# EAGLE design juan_foot (EAGLE 8.0.1)
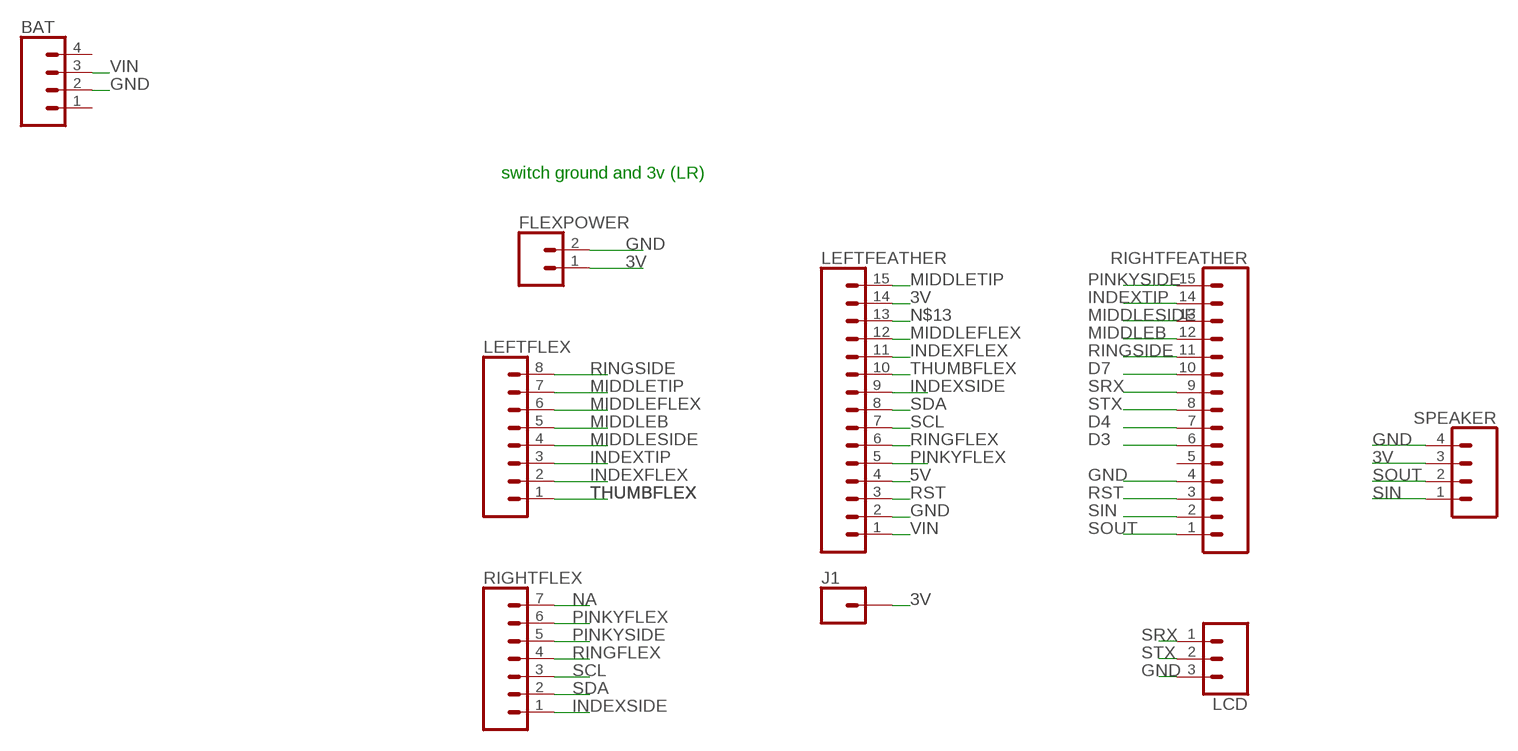
[diagram p0: schematic, sheet 1]

## Parts
BAT  CONN_04  [1X04]
FLEXPOWER  CONN_02  [1X02]
J1  CONN_01  [1X01]
LCD  CONN_03  [1X03]
LEFTFEATHER  CONN_15  [1X15]
LEFTFLEX  CONN_08"  [1X08]
RIGHTFEATHER  CONN_15  [1X15]
RIGHTFLEX  CONN_07  [1X07]
SPEAKER  CONN_04  [1X04]

## Nets
3V: FLEXPOWER.1 J1.1 LEFTFEATHER.14 SPEAKER.3
5V: LEFTFEATHER.4
D3: RIGHTFEATHER.6
D4: RIGHTFEATHER.7
D7: RIGHTFEATHER.10
GND: BAT.2 FLEXPOWER.2 LCD.3 LEFTFEATHER.2 RIGHTFEATHER.4 SPEAKER.4
INDEXFLEX: LEFTFEATHER.11 LEFTFLEX.2
INDEXSIDE: LEFTFEATHER.9 RIGHTFLEX.1
INDEXTIP: LEFTFLEX.3 RIGHTFEATHER.14
MIDDLEB: LEFTFLEX.5 RIGHTFEATHER.12
MIDDLEFLEX: LEFTFEATHER.12 LEFTFLEX.6
MIDDLESIDE: LEFTFLEX.4 RIGHTFEATHER.13
MIDDLETIP: LEFTFEATHER.15 LEFTFLEX.7
N$13: LEFTFEATHER.13
NA: RIGHTFLEX.7
PINKYFLEX: LEFTFEATHER.5 RIGHTFLEX.6
PINKYSIDE: RIGHTFEATHER.15 RIGHTFLEX.5
RINGFLEX: LEFTFEATHER.6 RIGHTFLEX.4
RINGSIDE: LEFTFLEX.8 RIGHTFEATHER.11
RST: LEFTFEATHER.3 RIGHTFEATHER.3
SCL: LEFTFEATHER.7 RIGHTFLEX.3
SDA: LEFTFEATHER.8 RIGHTFLEX.2
SIN: RIGHTFEATHER.2 SPEAKER.1
SOUT: RIGHTFEATHER.1 SPEAKER.2
SRX: LCD.1 RIGHTFEATHER.9
STX: LCD.2 RIGHTFEATHER.8
THUMBFLEX: LEFTFEATHER.10 LEFTFLEX.1
VIN: BAT.3 LEFTFEATHER.1
Unconnected: BAT.1 BAT.4 RIGHTFEATHER.5

## Notes on the sheet
- switch ground and 3v (LR)

## Library data of the parts
BAT SPEAKER = SparkFun-Connectors:CONN_04: Multi connection point. Often used as Generic Header-pin footprint for 0.1 inch spaced/style header connections On any of the 0.1 inch spaced packages, you can populate with these: Break Away Headers - Straight <https://www.sparkfun.com/products/116> (PRT-00116) Break Away Male Headers - Right Angle <https://www.sparkfun.com/products/553> (PRT-00553) Female Headers <https://www.sparkfun.com/products/115> (PRT-00115) Break Away Headers - Machine Pin <https://www.sparkfun.com/products/117> (PRT-00117) Break Away Female Headers - Swiss Machine Pin <https://www.sparkfun.com/products/743> (PRT-00743) For SCREWTERMINALS and SPRING TERMINALS visit here: Screw Terimnals on SparkFun.com <https://www.sparkfun.com/search/results?term=Screw+Terminals> (5mm/3.5mm/2.54mm spacing) This device is also useful as a general connection point to wire up your design to another part of your project. Our various solder wires solder well into these plated through hole pads. Hook-Up Wire - Assortment (Stranded, 22 AWG) <https://www.sparkfun.com/products/11375> (PRT-11375) Hook-Up Wire - Assortment (Solid Core, 22 AWG) <https://www.sparkfun.com/products/11367> (PRT-11367) View the entire wire category on our website here <https://www.sparkfun.com/categories/141> Special notes: Molex polarized connector foot print use with SKU : PRT-08231 with associated crimp pins and housings. 1MM SMD Version SKU: PRT-10208; PROD_ID: CONN-09696
FLEXPOWER = SparkFun-Connectors:CONN_02: Multi connection point. Often used as Generic Header-pin footprint for 0.1 inch spaced/style header connections On any of the 0.1 inch spaced packages, you can populate with these: Break Away Headers - Straight <https://www.sparkfun.com/products/116> (PRT-00116) Break Away Male Headers - Right Angle <https://www.sparkfun.com/products/553> (PRT-00553) Female Headers <https://www.sparkfun.com/products/115> (PRT-00115) Break Away Headers - Machine Pin <https://www.sparkfun.com/products/117> (PRT-00117) Break Away Female Headers - Swiss Machine Pin <https://www.sparkfun.com/products/743> (PRT-00743) For SCREWTERMINALS and SPRING TERMINALS visit here: Screw Terimnals on SparkFun.com <https://www.sparkfun.com/search/results?term=Screw+Terminals> (5mm/3.5mm/2.54mm spacing) This device is also useful as a general connection point to wire up your design to another part of your project. Our various solder wires solder well into these plated through hole pads. Hook-Up Wire - Assortment (Stranded, 22 AWG) <https://www.sparkfun.com/products/11375> (PRT-11375) Hook-Up Wire - Assortment (Solid Core, 22 AWG) <https://www.sparkfun.com/products/11367> (PRT-11367) View the entire wire category on our website here <https://www.sparkfun.com/categories/141> Special notes: Molex polarized connector foot print use with: PRT-08233 with associated crimp pins and housings. 2.54_SCREWTERM for use with PRT-10571. 3.5mm Screw Terminal footprints for PRT-08084 5mm Screw Terminal footprints for use with PRT-08432
J1 = SparkFun-Connectors:CONN_01: Single connection point. Often used as Generic Header-pin footprint for 0.1 inch spaced/style header connections On any of the 0.1 inch spaced packages, you can populate with these: Break Away Headers - Straight <https://www.sparkfun.com/products/116> (PRT-00116) Break Away Male Headers - Right Angle <https://www.sparkfun.com/products/553> (PRT-00553) Female Headers <https://www.sparkfun.com/products/115> (PRT-00115) Break Away Headers - Machine Pin <https://www.sparkfun.com/products/117> (PRT-00117) Break Away Female Headers - Swiss Machine Pin <https://www.sparkfun.com/products/743> (PRT-00743) This device is also useful as a general connection point to wire up your design to another part of your project. Our various solder wires solder well into these plated through hole pads. Hook-Up Wire - Assortment (Stranded, 22 AWG) <https://www.sparkfun.com/products/11375> (PRT-11375) Hook-Up Wire - Assortment (Solid Core, 22 AWG) <https://www.sparkfun.com/products/11367> (PRT-11367) View the entire wire category on our website here <https://www.sparkfun.com/categories/141> Special notes: SMTSO-256-ET is a "flush mount" nut for a 4-40 screw. We mostly use this on specialty testbeds; it is a nice way to connect hardware to your PCB at an adjustable hieght. Also note, the SNAP packages are for using a snappable style connector. We sell a baggie of snaps and they are also used on two LilyPad designs: Snap Assortment - 30 pack (male and female) <https://www.sparkfun.com/products/11347> (DEV-11347) LilyPad Arduino SimpleSnap <https://www.sparkfun.com/products/10941> (DEV-10941) LilyPad SimpleSnap Protoboard <https://www.sparkfun.com/products/10940> (DEV-10940)
LCD = SparkFun-Connectors:CONN_03: Multi connection point. Often used as Generic Header-pin footprint for 0.1 inch spaced/style header connections On any of the 0.1 inch spaced packages, you can populate with these: Break Away Headers - Straight <https://www.sparkfun.com/products/116> (PRT-00116) Break Away Male Headers - Right Angle <https://www.sparkfun.com/products/553> (PRT-00553) Female Headers <https://www.sparkfun.com/products/115> (PRT-00115) Break Away Headers - Machine Pin <https://www.sparkfun.com/products/117> (PRT-00117) Break Away Female Headers - Swiss Machine Pin <https://www.sparkfun.com/products/743> (PRT-00743) Stackable Header - 3 Pin (Female, 0.1") <https://www.sparkfun.com/products/13875> (PRT-13875) For SCREWTERMINALS and SPRING TERMINALS visit here: Screw Terimnals on SparkFun.com <https://www.sparkfun.com/search/results?term=Screw+Terminals> (5mm/3.5mm/2.54mm spacing) This device is also useful as a general connection point to wire up your design to another part of your project. Our various solder wires solder well into these plated through hole pads. Hook-Up Wire - Assortment (Stranded, 22 AWG) <https://www.sparkfun.com/products/11375> (PRT-11375) Hook-Up Wire - Assortment (Solid Core, 22 AWG) <https://www.sparkfun.com/products/11367> (PRT-11367) View the entire wire category on our website here <https://www.sparkfun.com/categories/141> Special notes: Molex polarized connector foot print use with SKU : PRT-08232 with associated crimp pins and housings.
LEFTFEATHER RIGHTFEATHER = SparkFun-Connectors:CONN_15: Multi connection point. Often used as Generic Header-pin footprint for 0.1 inch spaced/style header connections On any of the 0.1 inch spaced packages, you can populate with these: Break Away Headers - Straight <https://www.sparkfun.com/products/116> (PRT-00116) Break Away Male Headers - Right Angle <https://www.sparkfun.com/products/553> (PRT-00553) Female Headers <https://www.sparkfun.com/products/115> (PRT-00115) Break Away Headers - Machine Pin <https://www.sparkfun.com/products/117> (PRT-00117) Break Away Female Headers - Swiss Machine Pin <https://www.sparkfun.com/products/743> (PRT-00743) For SCREWTERMINALS and SPRING TERMINALS visit here: Screw Terimnals on SparkFun.com <https://www.sparkfun.com/search/results?term=Screw+Terminals> (5mm/3.5mm/2.54mm spacing) This device is also useful as a general connection point to wire up your design to another part of your project. Our various solder wires solder well into these plated through hole pads. Hook-Up Wire - Assortment (Stranded, 22 AWG) <https://www.sparkfun.com/products/11375> (PRT-11375) Hook-Up Wire - Assortment (Solid Core, 22 AWG) <https://www.sparkfun.com/products/11367> (PRT-11367) View the entire wire category on our website here <https://www.sparkfun.com/categories/141> Special notes: Molex polarized connector foot print use with SKU : PRT-08231 with associated crimp pins and housings. 1MM SMD Version SKU: PRT-10208 NOTES ON THE VARIANTS LOCK and LOCK_LONGPADS... This footprint was designed to help hold the alignment of a through-hole component (i.e. 6-pin header) while soldering it into place. You may notice that each hole has been shifted either up or down by 0.005 of an inch from it's more standard position (which is a perfectly straight line). This slight alteration caused the pins (the squares in the middle) to touch the edges of the holes. Because they are alternating, it causes a "brace" to hold the component in place. 0.005 has proven to be the perfect amount of "off-center" position when using our standard breakaway headers. Although looks a little odd when you look at the bare footprint, once you have a header in there, the alteration is very hard to notice. Also,if you push a header all the way into place, it is covered up entirely on the bottom side.
LEFTFLEX = SparkFun-Connectors:CONN_08: Multi connection point. Often used as Generic Header-pin footprint for 0.1 inch spaced/style header connections On any of the 0.1 inch spaced packages, you can populate with these: Break Away Headers - Straight <https://www.sparkfun.com/products/116> (PRT-00116) Break Away Male Headers - Right Angle <https://www.sparkfun.com/products/553> (PRT-00553) Female Headers <https://www.sparkfun.com/products/115> (PRT-00115) Break Away Headers - Machine Pin <https://www.sparkfun.com/products/117> (PRT-00117) Break Away Female Headers - Swiss Machine Pin <https://www.sparkfun.com/products/743> (PRT-00743) Arduino Stackable Header - 8 Pin <https://www.sparkfun.com/products/9279> (PRT-09279) For SCREWTERMINALS and SPRING TERMINALS visit here: Screw Terimnals on SparkFun.com <https://www.sparkfun.com/search/results?term=Screw+Terminals> (5mm/3.5mm/2.54mm spacing) This device is also useful as a general connection point to wire up your design to another part of your project. Our various solder wires solder well into these plated through hole pads. Hook-Up Wire - Assortment (Stranded, 22 AWG) <https://www.sparkfun.com/products/11375> (PRT-11375) Hook-Up Wire - Assortment (Solid Core, 22 AWG) <https://www.sparkfun.com/products/11367> (PRT-11367) View the entire wire category on our website here <https://www.sparkfun.com/categories/141> Special notes: Molex polarized connector foot print use with SKU : PRT-08231 with associated crimp pins and housings. 1MM SMD Version SKU: PRT-10208 NOTES ON THE VARIANTS LOCK and LOCK_LONGPADS... This footprint was designed to help hold the alignment of a through-hole component (i.e. 6-pin header) while soldering it into place. You may notice that each hole has been shifted either up or down by 0.005 of an inch from it's more standard position (which is a perfectly straight line). This slight alteration caused the pins (the squares in the middle) to touch the edges of the holes. Because they are alternating, it causes a "brace" to hold the component in place. 0.005 has proven to be the perfect amount of "off-center" position when using our standard breakaway headers. Although looks a little odd when you look at the bare footprint, once you have a header in there, the alteration is very hard to notice. Also,if you push a header all the way into place, it is covered up entirely on the bottom side.; PROD_ID: CONN-08438
RIGHTFLEX = SparkFun-Connectors:CONN_07: Multi connection point. Often used as Generic Header-pin footprint for 0.1 inch spaced/style header connections On any of the 0.1 inch spaced packages, you can populate with these: Break Away Headers - Straight <https://www.sparkfun.com/products/116> (PRT-00116) Break Away Male Headers - Right Angle <https://www.sparkfun.com/products/553> (PRT-00553) Female Headers <https://www.sparkfun.com/products/115> (PRT-00115) Break Away Headers - Machine Pin <https://www.sparkfun.com/products/117> (PRT-00117) Break Away Female Headers - Swiss Machine Pin <https://www.sparkfun.com/products/743> (PRT-00743) For SCREWTERMINALS and SPRING TERMINALS visit here: Screw Terimnals on SparkFun.com <https://www.sparkfun.com/search/results?term=Screw+Terminals> (5mm/3.5mm/2.54mm spacing) This device is also useful as a general connection point to wire up your design to another part of your project. Our various solder wires solder well into these plated through hole pads. Hook-Up Wire - Assortment (Stranded, 22 AWG) <https://www.sparkfun.com/products/11375> (PRT-11375) Hook-Up Wire - Assortment (Solid Core, 22 AWG) <https://www.sparkfun.com/products/11367> (PRT-11367) View the entire wire category on our website here <https://www.sparkfun.com/categories/141> Special notes: Molex polarized connector foot print use with SKU : PRT-08231 with associated crimp pins and housings. 1MM SMD Version SKU: PRT-10208 NOTES ON THE VARIANTS LOCK and LOCK_LONGPADS... This footprint was designed to help hold the alignment of a through-hole component (i.e. 6-pin header) while soldering it into place. You may notice that each hole has been shifted either up or down by 0.005 of an inch from it's more standard position (which is a perfectly straight line). This slight alteration caused the pins (the squares in the middle) to touch the edges of the holes. Because they are alternating, it causes a "brace" to hold the component in place. 0.005 has proven to be the perfect amount of "off-center" position when using our standard breakaway headers. Although looks a little odd when you look at the bare footprint, once you have a header in there, the alteration is very hard to notice. Also,if you push a header all the way into place, it is covered up entirely on the bottom side.

## Board
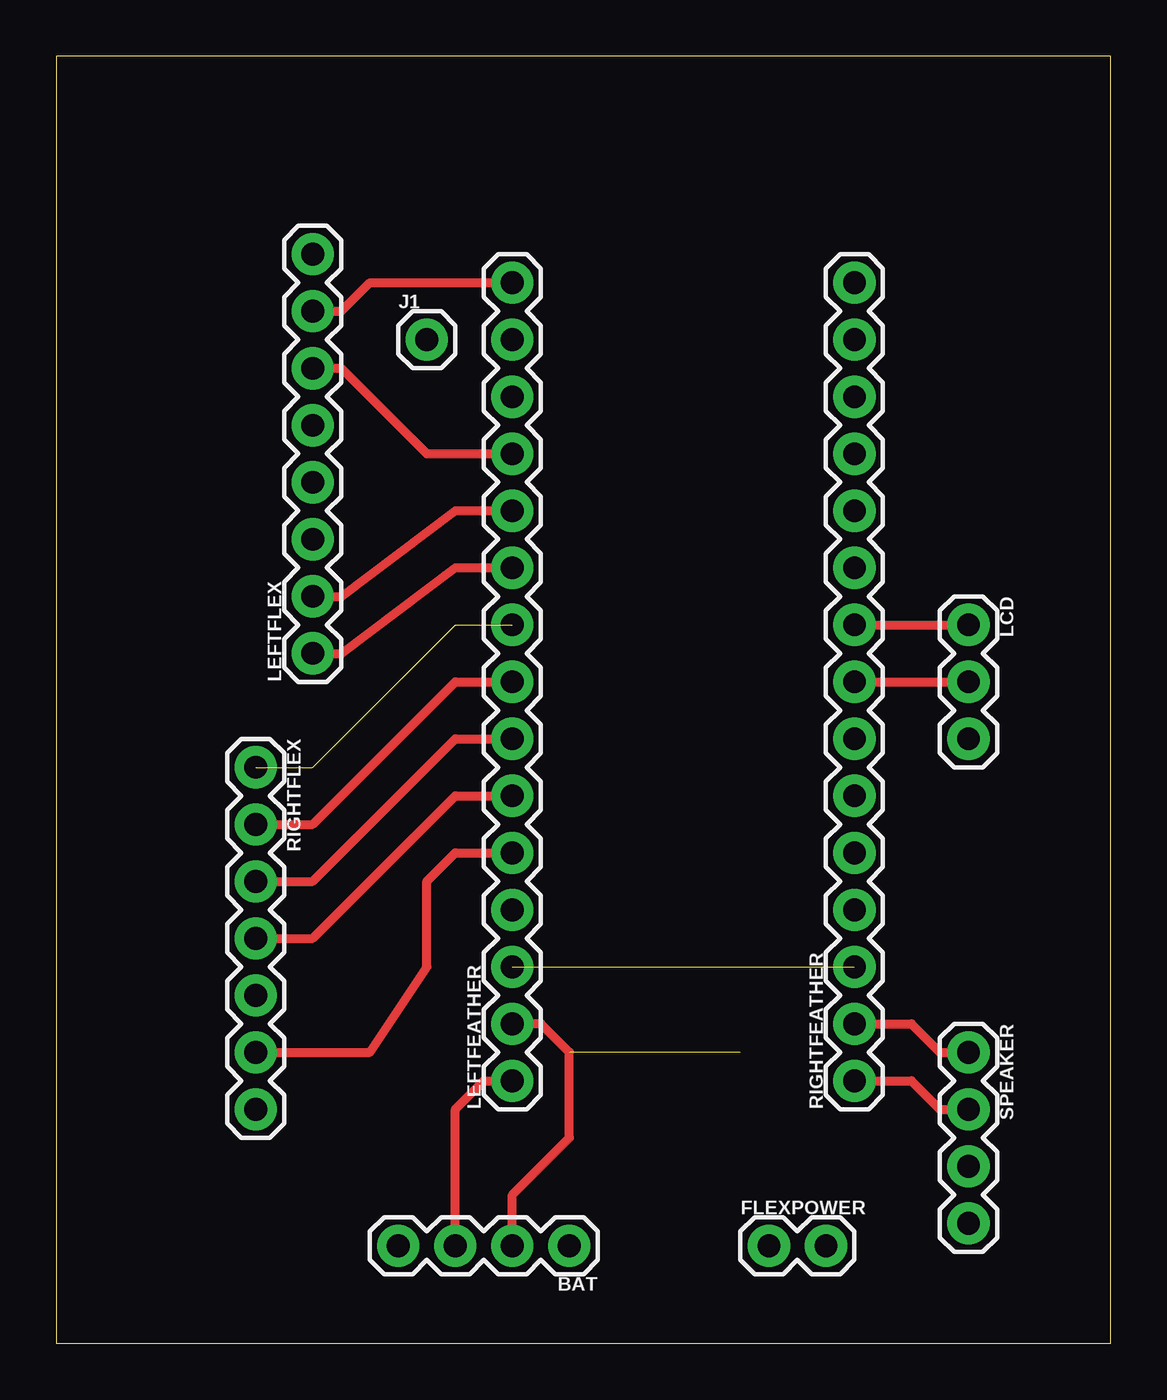
[diagram p1: board, top side]
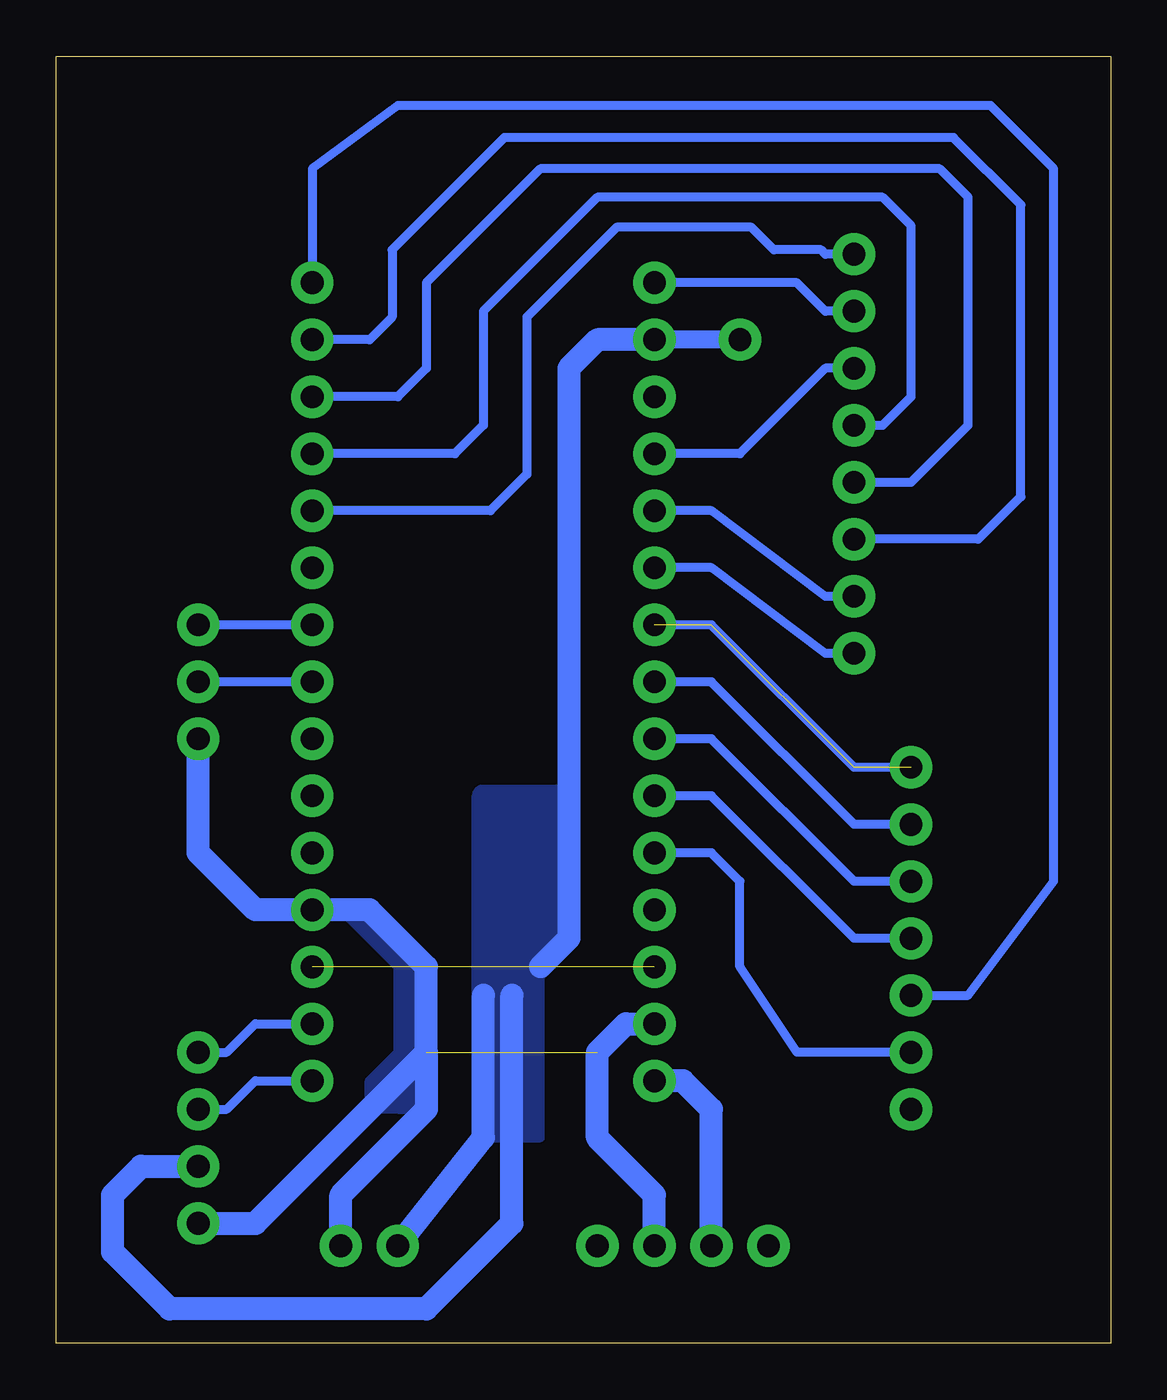
[diagram p2: board, bottom side, seen from below]

Size 46.97 x 57.36 mm. Coordinates in mm from the lower left corner, seen from the top.
Outline: 0,0 46.97,0 46.97,57.36 0,57.36 0,0
Copper layers (1*16): Top 0.035mm / dielectric 1.5mm / Bottom 0.035mm
Design rules "default": minimum track width 10mil, minimum drill 24mil, track to track 8mil, track to pad 8mil, pad to pad 8mil, via to via 8mil, smd to smd 8mil, copper to edge 40mil, drill to drill 8mil, minimum pad ring 10mil, minimum via ring 8mil, stop-mask expansion 4mil, vias tented up to drill 0mil, thermal gap 10mil

### Footprints (pad centres in the part's own frame; a part is rotated, then mirrored left to right if it is on the bottom)
1X04 = drill 1.016 pad 1.88: 1 0,0; 2 2.54,0; 3 5.08,0; 4 7.62,0
1X02 = drill 1.016 pad 1.88: 1 0,0; 2 2.54,0
1X01 = drill 1.016 pad 1.88: 1 0,0
1X03 = drill 1.016 pad 1.88: 1 0,0; 2 2.54,0; 3 5.08,0
1X15 = drill 1.016 pad 1.88: 1 0,0; 2 2.54,0; 3 5.08,0; 4 7.62,0; 5 10.16,0; 6 12.7,0; 7 15.24,0; 8 17.78,0; 9 20.32,0; 10 22.86,0; 11 25.4,0; 12 27.94,0; 13 30.48,0; 14 33.02,0; 15 35.56,0
1X08 = drill 1.016 pad 1.88: 1 0,0; 2 2.54,0; 3 5.08,0; 4 7.62,0; 5 10.16,0; 6 12.7,0; 7 15.24,0; 8 17.78,0
1X07 = drill 1.016 pad 1.88: 1 0,0; 2 2.54,0; 3 5.08,0; 4 7.62,0; 5 10.16,0; 6 12.7,0; 7 15.24,0

### Placement (x,y rotation side)
BAT  22.86,4.35 180 top
FLEXPOWER  31.75,4.35 0 top
J1  16.51,44.72 0 top
LCD  40.64,32.02 270 top
LEFTFEATHER  20.32,11.7 90 top
LEFTFLEX  11.43,30.75 90 top
RIGHTFEATHER  35.56,11.7 90 top
RIGHTFLEX  8.89,25.67 270 top
SPEAKER  40.64,12.97 270 top

### Tracks (layer width: path | path; a pad name or v marks a point on that pad's centre or on a via)
3V
  Bottom 0.813: J1.1 LEFTFEATHER.14
  Bottom 1.016: LEFTFEATHER.14 22.86,44.72 24.13,43.45 24.13,18.05 25.4,16.78 | SPEAKER.3 43.18,7.89 44.45,6.62 44.45,4.08 41.91,1.54 30.48,1.54 26.67,5.35 26.67,15.51 | FLEXPOWER.1 27.94,9.16 27.94,15.51
  pour Bottom: 25.4,9.16 25.4,16.78 27.94,16.78 27.94,9.16
  pour Bottom: 27.94,15.51 27.94,24.4 24.13,24.4 24.13,18.05 26.67,15.51
GND  (1 unrouted)
  Top 0.406: BAT.2 20.32,6.62 22.86,9.16 22.86,12.97 21.59,14.24 LEFTFEATHER.2
  Bottom 1.016: LEFTFEATHER.2 21.59,14.24 22.86,12.97 22.86,9.16 20.32,6.62 BAT.2 | FLEXPOWER.2 34.29,6.62 30.48,10.43 30.48,12.97 | 30.48,12.97 30.48,16.78 33.02,19.32 RIGHTFEATHER.4 38.1,19.32 40.64,21.86 LCD.3 | SPEAKER.4 38.1,5.35 30.48,12.97
  pour Bottom: 30.48,16.78 31.75,16.78 31.75,10.43 30.48,10.43
  pour Bottom: 30.48,10.43 33.02,10.43 33.02,11.7 31.75,12.97 30.48,12.97
  pour Bottom: 31.75,16.78 34.29,19.32 33.02,19.32 30.48,16.78
INDEXFLEX
  Top 0.406: LEFTFLEX.2 12.7,33.29 17.78,37.1 LEFTFEATHER.11
  Bottom 0.406: LEFTFLEX.2 12.7,33.29 17.78,37.1 LEFTFEATHER.11
INDEXSIDE  (3 unrouted)
  Bottom 0.406: RIGHTFLEX.1 11.43,25.67 17.78,32.02 LEFTFEATHER.9
INDEXTIP
  Bottom 0.406: RIGHTFEATHER.14 33.01,44.72 32,45.73 32,48.73 27,53.73 7,53.73 4,50.73 4,37.73 5.9,35.83 LEFTFLEX.3
MIDDLEB
  Bottom 0.406: RIGHTFEATHER.12 29.21,39.64 27.94,40.91 27.94,45.99 22.86,51.07 10.16,51.07 8.89,49.8 8.89,42.18 10.16,40.91 LEFTFLEX.5
MIDDLEFLEX
  Top 0.406: LEFTFLEX.6 12.7,43.45 16.51,39.64 LEFTFEATHER.12
  Bottom 0.406: LEFTFLEX.6 12.7,43.45 16.51,39.64 LEFTFEATHER.12
MIDDLESIDE
  Bottom 0.406: LEFTFLEX.4 8.89,38.37 6.35,40.91 6.35,51.07 7.62,52.34 25.4,52.34 30.48,47.26 30.48,43.45 31.75,42.18 RIGHTFEATHER.13
MIDDLETIP
  Top 0.406: LEFTFLEX.7 12.7,45.99 13.97,47.26 LEFTFEATHER.15
  Bottom 0.406: LEFTFLEX.7 12.7,45.99 13.97,47.26 LEFTFEATHER.15
PINKYFLEX
  Top 0.406: RIGHTFLEX.6 13.97,12.97 16.51,16.78 16.51,20.59 17.78,21.86 LEFTFEATHER.5
  Bottom 0.406: RIGHTFLEX.6 13.97,12.97 16.51,16.78 16.51,20.59 17.78,21.86 LEFTFEATHER.5
PINKYSIDE
  Bottom 0.406: RIGHTFLEX.5 6.35,15.51 2.54,20.59 2.54,52.34 5.35,55.15 31.75,55.15 35.56,52.34 RIGHTFEATHER.15
RINGFLEX
  Top 0.406: RIGHTFLEX.4 11.43,18.05 17.78,24.4 LEFTFEATHER.6
  Bottom 0.406: RIGHTFLEX.4 11.43,18.05 17.78,24.4 LEFTFEATHER.6
RINGSIDE
  Bottom 0.406: LEFTFLEX.8 12.7,48.53 12.9,48.73 15,48.73 16,49.73 22,49.73 26,45.73 26,38.73 27.63,37.1 RIGHTFEATHER.11
RST  (1 unrouted)
SCL
  Top 0.406: RIGHTFLEX.3 11.43,20.59 17.78,26.94 LEFTFEATHER.7
  Bottom 0.406: RIGHTFLEX.3 11.43,20.59 17.78,26.94 LEFTFEATHER.7
SDA
  Top 0.406: RIGHTFLEX.2 11.43,23.13 17.78,29.48 LEFTFEATHER.8
  Bottom 0.406: RIGHTFLEX.2 11.43,23.13 17.78,29.48 LEFTFEATHER.8
SIN
  Top 0.406: RIGHTFEATHER.2 38.1,14.24 39.37,12.97 SPEAKER.1
  Bottom 0.406: SPEAKER.1 39.37,12.97 38.1,14.24 RIGHTFEATHER.2
SOUT
  Top 0.406: RIGHTFEATHER.1 38.1,11.7 39.37,10.43 SPEAKER.2
  Bottom 0.406: SPEAKER.2 39.37,10.43 38.1,11.7 RIGHTFEATHER.1
SRX
  Top 0.406: RIGHTFEATHER.9 LCD.1
  Bottom 0.406: RIGHTFEATHER.9 LCD.1
STX
  Top 0.406: RIGHTFEATHER.8 LCD.2
  Bottom 0.406: RIGHTFEATHER.8 LCD.2
THUMBFLEX
  Top 0.406: LEFTFLEX.1 12.7,30.75 17.78,34.56 LEFTFEATHER.10
  Bottom 0.406: LEFTFLEX.1 12.7,30.75 17.78,34.56 LEFTFEATHER.10
VIN
  Top 0.406: BAT.3 17.78,10.43 19.05,11.7 LEFTFEATHER.1
  Bottom 1.016: BAT.3 17.78,10.43 19.05,11.7 LEFTFEATHER.1